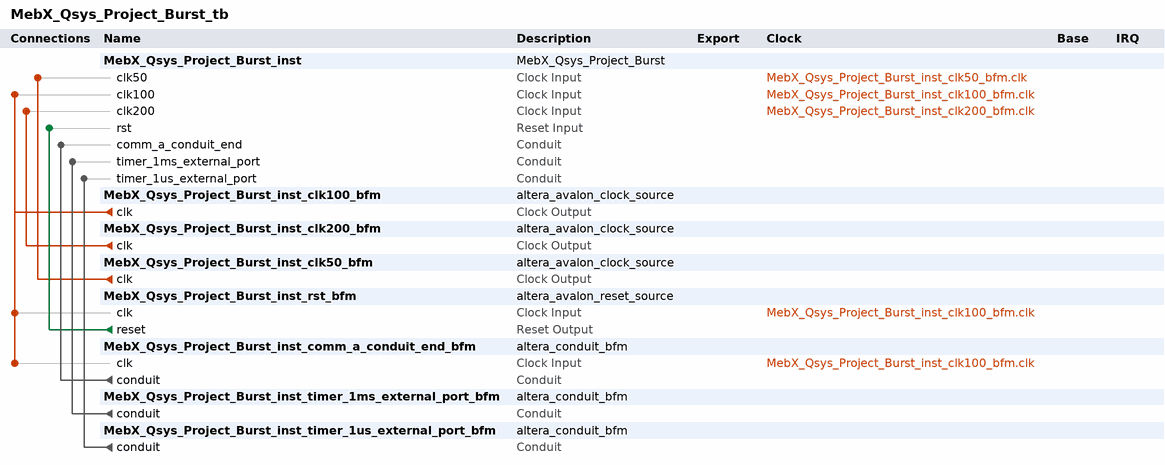
[diagram p0: system contents]
# Platform Designer (Qsys) system MebX_Qsys_Project_Burst_tb, Stratix IV EP4SGX230KF40C2
# Parameters at their usual value, and those the tool derives, are not listed.
package require -exact qsys 16.1
create_system MebX_Qsys_Project_Burst_tb
set_project_property DEVICE_FAMILY {Stratix IV}
set_project_property DEVICE EP4SGX230KF40C2

add_instance MebX_Qsys_Project_Burst_inst MebX_Qsys_Project_Burst 1.0

add_instance MebX_Qsys_Project_Burst_inst_clk100_bfm altera_avalon_clock_source 16.1
set_instance_parameter_value MebX_Qsys_Project_Burst_inst_clk100_bfm CLOCK_RATE 100000000

add_instance MebX_Qsys_Project_Burst_inst_clk200_bfm altera_avalon_clock_source 16.1
set_instance_parameter_value MebX_Qsys_Project_Burst_inst_clk200_bfm CLOCK_RATE 200000000

add_instance MebX_Qsys_Project_Burst_inst_clk50_bfm altera_avalon_clock_source 16.1

add_instance MebX_Qsys_Project_Burst_inst_rst_bfm altera_avalon_reset_source 16.1
set_instance_parameter_value MebX_Qsys_Project_Burst_inst_rst_bfm ASSERT_HIGH_RESET 0
set_instance_parameter_value MebX_Qsys_Project_Burst_inst_rst_bfm INITIAL_RESET_CYCLES 50

add_instance MebX_Qsys_Project_Burst_inst_comm_a_conduit_end_bfm altera_conduit_bfm 16.1
set_instance_parameter_value MebX_Qsys_Project_Burst_inst_comm_a_conduit_end_bfm CLOCKED_SIGNAL true
set_instance_parameter_value MebX_Qsys_Project_Burst_inst_comm_a_conduit_end_bfm ENABLE_RESET false
set_instance_parameter_value MebX_Qsys_Project_Burst_inst_comm_a_conduit_end_bfm SIGNAL_DIRECTIONS output,output,input,input
set_instance_parameter_value MebX_Qsys_Project_Burst_inst_comm_a_conduit_end_bfm SIGNAL_ROLES spw_si_signal,spw_di_signal,spw_do_signal,spw_so_signal
set_instance_parameter_value MebX_Qsys_Project_Burst_inst_comm_a_conduit_end_bfm SIGNAL_WIDTHS 1,1,1,1

add_instance MebX_Qsys_Project_Burst_inst_timer_1ms_external_port_bfm altera_conduit_bfm 16.1
set_instance_parameter_value MebX_Qsys_Project_Burst_inst_timer_1ms_external_port_bfm CLOCKED_SIGNAL false
set_instance_parameter_value MebX_Qsys_Project_Burst_inst_timer_1ms_external_port_bfm ENABLE_RESET false
set_instance_parameter_value MebX_Qsys_Project_Burst_inst_timer_1ms_external_port_bfm SIGNAL_DIRECTIONS input
set_instance_parameter_value MebX_Qsys_Project_Burst_inst_timer_1ms_external_port_bfm SIGNAL_WIDTHS 1

add_instance MebX_Qsys_Project_Burst_inst_timer_1us_external_port_bfm altera_conduit_bfm 16.1
set_instance_parameter_value MebX_Qsys_Project_Burst_inst_timer_1us_external_port_bfm CLOCKED_SIGNAL false
set_instance_parameter_value MebX_Qsys_Project_Burst_inst_timer_1us_external_port_bfm ENABLE_RESET false
set_instance_parameter_value MebX_Qsys_Project_Burst_inst_timer_1us_external_port_bfm SIGNAL_DIRECTIONS input
set_instance_parameter_value MebX_Qsys_Project_Burst_inst_timer_1us_external_port_bfm SIGNAL_WIDTHS 1

# connections
add_connection MebX_Qsys_Project_Burst_inst_clk50_bfm.clk MebX_Qsys_Project_Burst_inst.clk50 clock
add_connection MebX_Qsys_Project_Burst_inst_clk100_bfm.clk MebX_Qsys_Project_Burst_inst.clk100 clock
add_connection MebX_Qsys_Project_Burst_inst_clk100_bfm.clk MebX_Qsys_Project_Burst_inst_comm_a_conduit_end_bfm.clk clock
add_connection MebX_Qsys_Project_Burst_inst_clk100_bfm.clk MebX_Qsys_Project_Burst_inst_rst_bfm.clk clock
add_connection MebX_Qsys_Project_Burst_inst_clk200_bfm.clk MebX_Qsys_Project_Burst_inst.clk200 clock
add_connection MebX_Qsys_Project_Burst_inst_rst_bfm.reset MebX_Qsys_Project_Burst_inst.rst reset
add_connection MebX_Qsys_Project_Burst_inst_comm_a_conduit_end_bfm.conduit MebX_Qsys_Project_Burst_inst.comm_a_conduit_end conduit
add_connection MebX_Qsys_Project_Burst_inst_timer_1ms_external_port_bfm.conduit MebX_Qsys_Project_Burst_inst.timer_1ms_external_port conduit
add_connection MebX_Qsys_Project_Burst_inst_timer_1us_external_port_bfm.conduit MebX_Qsys_Project_Burst_inst.timer_1us_external_port conduit

set_interconnect_requirement {$system} qsys_mm.clockCrossingAdapter HANDSHAKE
set_interconnect_requirement {$system} qsys_mm.enableEccProtection FALSE
set_interconnect_requirement {$system} qsys_mm.insertDefaultSlave FALSE
set_interconnect_requirement {$system} qsys_mm.maxAdditionalLatency 1

save_system MebX_Qsys_Project_Burst_tb.qsys
